# Altium schematic sheet MCU.SchDoc
size A4
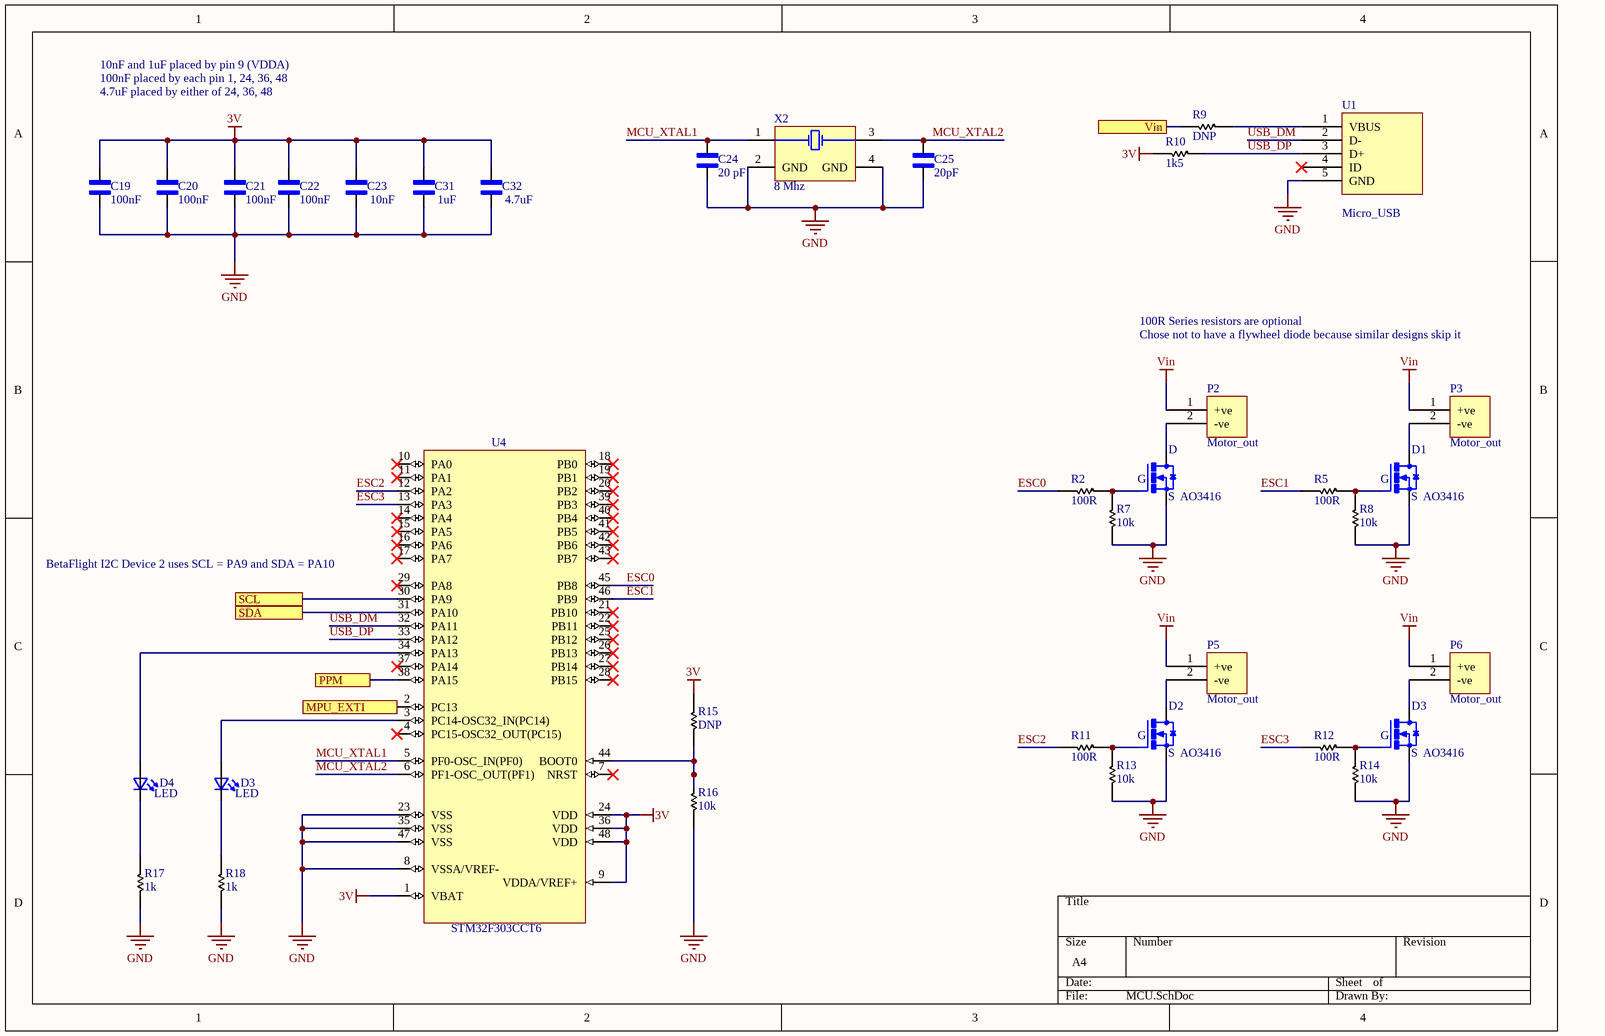
[diagram p0: MCU.SchDoc]

## Parts
1  AO3416  [SOT23-3]
2  AO3416  [SOT23-3]
3  AO3416  [SOT23-3]
?  AO3416  [SOT23-3]
C19  100nF  [0402 Capacitor Generic]
C20  100nF  [0402 Capacitor Generic]
C21  100nF  [0402 Capacitor Generic]
C22  100nF  [0402 Capacitor Generic]
C23  10nF  [0402 Capacitor Generic]
C24  20 pF  [0402 Capacitor Generic]
C25  20pF  [0402 Capacitor Generic]
C31  1uF  [0402 Capacitor Generic]
C32  4.7uF  [0402 Capacitor Generic]
D3  LED  [0402 LED Generic]
D4  LED  [0402 LED Generic]
P2  Motor_out  [MOLEX_530470210]
P3  Motor_out  [MOLEX_530470210]
P5  Motor_out  [MOLEX_530470210]
P6  Motor_out  [MOLEX_530470210]
R2  100R  [0402 Resistor Generic]
R5  100R  [0402 Resistor Generic]
R7  10k  [0402 Resistor Generic]
R8  10k  [0402 Resistor Generic]
R9  DNP  [0402 Resistor Generic]
R10  1k5  [0402 Resistor Generic]
R11  100R  [0402 Resistor Generic]
R12  100R  [0402 Resistor Generic]
R13  10k  [0402 Resistor Generic]
R14  10k  [0402 Resistor Generic]
R15  DNP  [0402 Resistor Generic]
R16  10k  [0402 Resistor Generic]
R17  1k  [0402 Resistor Generic]
R18  1k  [0402 Resistor Generic]
U1  Micro_USB  [U254-051T-4BH83-F1S]
U4  STM32F303CCT6  [STM-LQFP48_N]
X2  8 Mhz  [TSX-3225]

## Ports
MPU_EXTI, PPM, SCL, SDA, Vin

## Nets
3V: C19.1 C20.1 C21.1 C22.1 C23.1 C31.1 C32.1 R10.1 R15.1 U4.1(VBAT) U4.9(VDDA/VREF+) U4.24(VDD) U4.36(VDD) U4.48(VDD)
GND: 1.2(S) 2.2(S) 3.2(S) ?.2(S) C19.2 C20.2 C21.2 C22.2 C23.2 C24.2 C25.2 C31.2 C32.2 R7.2 R8.2 R13.2 R14.2 R16.2 R17.2 R18.2 U1.5(GND) U4.8(VSSA/VREF-) U4.23(VSS) U4.35(VSS) U4.47(VSS) X2.2(GND) X2.4(GND)
Vin: P2.1(+ve) P3.1(+ve) P5.1(+ve) P6.1(+ve)
ESC0: R2.1 U4.45(PB8)
ESC1: R5.1 U4.46(PB9)
ESC2: R11.1 U4.12(PA2)
ESC3: R12.1 U4.13(PA3)
MCU_XTAL1: C24.1 U4.5(PF0-OSC_IN(PF0)) X2.1(X1)
MCU_XTAL2: C25.1 U4.6(PF1-OSC_OUT(PF1)) X2.3(X2)
MPU_EXTI: U4.2(PC13) ; port MPU_EXTI
PPM: U4.38(PA15) ; port PPM
SCL: U4.30(PA9) ; port SCL
SDA: U4.31(PA10) ; port SDA
USB_DM: U1.2(D-) U4.32(PA11)
USB_DP: R10.2 U1.3(D+) U4.33(PA12)
Vin: R9.1 ; port Vin  [a separate net that carries the same name]
Net1_1: 1.1(G) R5.2 R8.1
Net1_3: 1.3(D) P3.2(-ve)
Net2_1: 2.1(G) R11.2 R13.1
Net2_3: 2.3(D) P5.2(-ve)
Net3_1: 3.1(G) R12.2 R14.1
Net3_3: 3.3(D) P6.2(-ve)
Net?_1: ?.1(G) R2.2 R7.1
Net?_3: ?.3(D) P2.2(-ve)
NetD3_1: D3.1(K2) R18.1
NetD3_2: D3.2(A2) U4.3(PC14-OSC32_IN(PC14))
NetD4_1: D4.1(K2) R17.1
NetD4_2: D4.2(A2) U4.34(PA13)
NetR9_2: R9.2 U1.1(VBUS)
NetR15_2: R15.2 R16.1 U4.44(BOOT0)

Not connected (* = marked no-connect by the designer): U1 4(ID)*; U4 4(PC15-OSC32_OUT(PC15))* 7(NRST)* 10(PA0)* 11(PA1)* 14(PA4)* 15(PA5)* 16(PA6)* 17(PA7)* 18(PB0)* 19(PB1)* 20(PB2)* 21(PB10)* 22(PB11)* 25(PB12)* 26(PB13)* 27(PB14)* 28(PB15)* 29(PA8)* 37(PA14)* 39(PB3)* 40(PB4)* 41(PB5)* 42(PB6)* 43(PB7)*

## Notes on the sheet
- 10nF and 1uF placed by pin 9 (VDDA)
- 100nF placed by each pin 1, 24, 36, 48
- 4.7uF placed by either of 24, 36, 48
- Chose not to have a flywheel diode because similar designs skip it
- 100R Series resistors are optional
- BetaFlight I2C Device 2 uses SCL = PA9 and SDA = PA10

## Library data of the parts
1-3 ? = AO3416: N-Channel 20V 6.5A _Ta_ 1.4W _Ta_ Surface Mount SOT-23-3L; MF: Alpha &; Digi-Key_Part_Number: 785-1011-1-ND; Package: SOT-23 Alpha &amp; Omega Semiconductor; MP: AO3416; Value: *; SnapEDA_Link: https://www.snapeda.com/parts/AO3416/Alpha%20%26%20Omega%20Semiconductor%20Inc./view-part/555673/?ref=snap; Digi-Key_Purchase_URL: https://www.digikey.com/product-detail/en/alpha-omega-semiconductor-inc/AO3416/785-1011-1-ND/1855953?utm_source=snapeda&utm_medium=aggregator&utm_campaign=symbol
C19-C25 C31 C32 = 0402 Ceramic Capacitor: Generic 0402 Ceramic Capacitor; MP: AC0402FR-071ML; MF: Yageo; Package: 1005 Yageo; SnapEDA_Link: https://www.snapeda.com/parts/AC0402FR-071ML/Yageo/view-part/940461/?ref=snap; Value: *; Mouser-Purchase-URL: https://snapeda.com/shop?store=Mouser&id=940461; DigiKey-Purchase-URL: https://snapeda.com/shop?store=DigiKey&id=940461
D3 D4 = 0402 Generic LED: Value: *
R2 R5 R7 R8 R10-R18 = 0402 Generic Resistor: Generic 0402 Resistor
R9 = 0402 Generic Resistor: Do Not Place
U1 = Micro_USB: XKB Connectivity U254-051T-4BH83-F1S
U4 = STM32F303CCT6: MCU 32-bit STM32F ARM Cortex M4 RISC 256KB Flash 2.5V/3.3V 48-Pin LQFP Tray; Manufacturer: STMicroelectronics; Number of I/Os: 37; Interface: I2C,SPI,USB,CAN,IrDA,UART,USART,LIN,I2S; Frequency: 72MHz; RAM Size: 40KB; Number of Timers/Counters: 10; Oscillator Type: Internal; Number of Programmable I/O: 27; Data Bus Width: 32b; Watchdog Timer: Yes; Peripherals: POR,PWM,WDT,DMA; Max Supply Voltage: 3.6V; Min Supply Voltage: 2V; Number of ADC Channels: 39; Number of SPI Channels: 3; Number of I2C Channels: 2; Number of USB Channels: 1; Supplier 1: Digi-Key; Manufacturer Part Number: STM32F303CCT6; RoHS: Yes; Category: Microcontrollers; Stock 1: 6096; Pricing 1: 1=6.33000, 10=5.68700, 25=5.37600, 100=4.65930, 250=4.42040, 500=3.96640, 1000=3.34516, 2500=3.17790, 5000=3.05843 (USD); Case/Package: LQFP; Number of Pins: 48; Contact Plating: Gold; Min Operating Temperature: -40°C; Max Operating Temperature: 85°C; Packaging: Tray; Max Frequency: 72MHz; Memory Type: FLASH; Memory Size: 256KB; Core Architecture: ARM; Package Quantity: 250; Length: 10mm; Height: 1.45mm; Width: 7.2mm; Radiation Hardening: No; Lead Free: Lead Free; REACH SVHC: No SVHC; ComponentLink1URL: https://datasheet.ciiva.com/14666/0900766b81171360-14666656.pdf?src-supplier=RSComponents; ComponentLink1Description: https://datasheet.ciiva.com/14666/0900766b81171360-14666656.pdf?src-supplier=RSComponents; ComponentLink2URL: https://datasheet.ciiva.com/8055/1831499-8055015.pdf?src-supplier=Element14; ComponentLink2Description: https://datasheet.ciiva.com/8055/1831499-8055015.pdf?src-supplier=Element14; Supplier Part Number 1: 497-13318-ND
X2 = XTY 7325-0800A2010-00: 8MHz ±10ppm 20pF 400Ω; ComponentLink1URL: https://support.epson.biz/td/api/doc_check.php?dl=brief_FA-238V_en.pdf&src-supplier=Digi-Key; ComponentLink1Description: https://support.epson.biz/td/api/doc_check.php?dl=brief_FA-238V_en.pdf&src-supplier=Digi-Key